# Altium schematic sheet MCU.SchDoc
size A
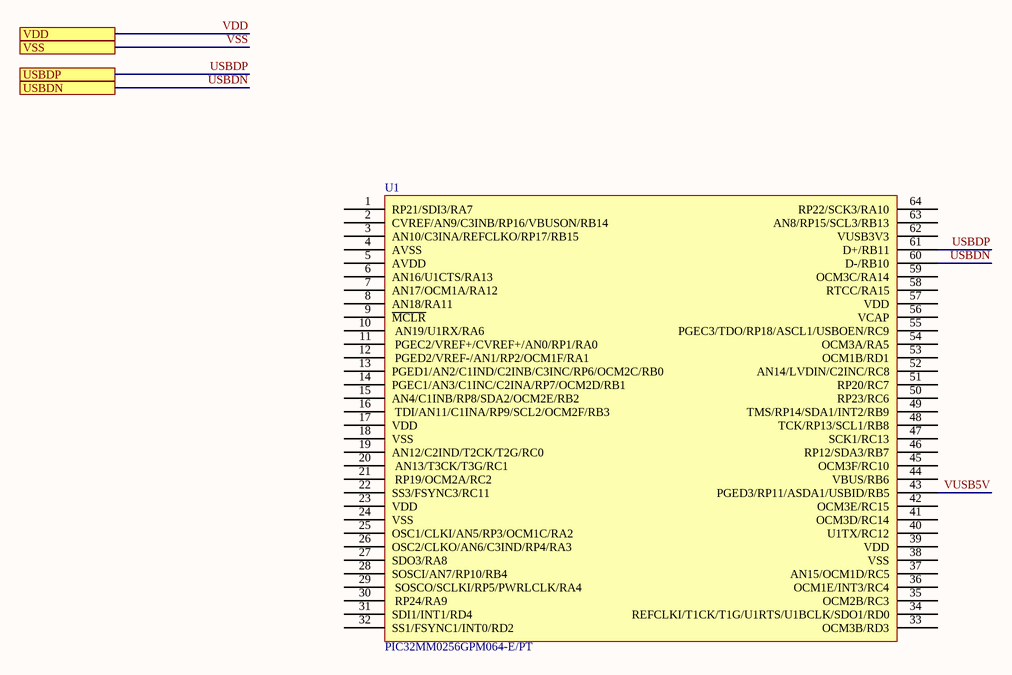
[diagram p0: MCU.SchDoc]

## Parts
U1  PIC32MM0256GPM064-E/PT  [TQFP-64]

## Ports
USBDN, USBDP, VDD, VSS

## Nets
USBDN: U1.60(D-/RB10) ; port USBDN
USBDP: U1.61(D+/RB11) ; port USBDP
VDD: port VDD
VSS: port VSS
VUSB5V: U1.43(PGED3/RP11/ASDA1/USBID/RB5)

Not connected (* = marked no-connect by the designer): U1 1(RP21/SDI3/RA7) 2(CVREF/AN9/C3INB/RP16/VBUSON/RB14) 3(AN10/C3INA/REFCLKO/RP17/RB15) 4(AVSS) 5(AVDD) 6(AN16/U1CTS/RA13) 7(AN17/OCM1A/RA12) 8(AN18/RA11) 9(~{MCLR}) 10(_AN19/U1RX/RA6) 11(_PGEC2/VREF+/CVREF+/AN0/RP1/RA0) 12(_PGED2/VREF-/AN1/RP2/OCM1F/RA1) 13(PGED1/AN2/C1IND/C2INB/C3INC/RP6/OCM2C/RB0) 14(PGEC1/AN3/C1INC/C2INA/RP7/OCM2D/RB1) 15(AN4/C1INB/RP8/SDA2/OCM2E/RB2) 16(_TDI/AN11/C1INA/RP9/SCL2/OCM2F/RB3) 17(VDD) 18(VSS) 19(AN12/C2IND/T2CK/T2G/RC0) 20(_AN13/T3CK/T3G/RC1) 21(_RP19/OCM2A/RC2) 22(SS3/FSYNC3/RC11) 23(VDD) 24(VSS) 25(OSC1/CLKI/AN5/RP3/OCM1C/RA2_) 26(OSC2/CLKO/AN6/C3IND/RP4/RA3) 27(SDO3/RA8) 28(SOSCI/AN7/RP10/RB4) 29(_SOSCO/SCLKI/RP5/PWRLCLK/RA4) 30(_RP24/RA9) 31(SDI1/INT1/RD4) 32(SS1/FSYNC1/INT0/RD2) 33(OCM3B/RD3) 34(REFCLKI/T1CK/T1G/U1RTS/U1BCLK/SDO1/RD0) 35(OCM2B/RC3) 36(_OCM1E/INT3/RC4) 37(_AN15/OCM1D/RC5) 38(VSS) 39(VDD) 40(U1TX/RC12) 41(OCM3D/RC14) 42(OCM3E/RC15) 44(VBUS/RB6) 45(OCM3F/RC10) 46(RP12/SDA3/RB7) 47(SCK1/RC13) 48(TCK/RP13/SCL1/RB8) 49(_TMS/RP14/SDA1/INT2/RB9) 50(RP23/RC6) 51(RP20/RC7) 52(AN14/LVDIN/C2INC/RC8) 53(OCM1B/RD1) 54(OCM3A/RA5) 55(_PGEC3/TDO/RP18/ASCL1/USBOEN/RC9) 56(VCAP) 57(VDD) 58(RTCC/RA15) 59(OCM3C/RA14) 62(VUSB3V3) 63(AN8/RP15/SCL3/RB13) 64(RP22/SCK3/RA10)

## Library data of the parts
U1 = PIC32MM0256GPM064-E/PT: 32-bit Microcontrollers - MCU 256KB Flash, 32KB RAM, 79 CoreMark at 25MHz, Low Power microMIPS; Populate: P; Value: PIC32MM0256GPM064-E/PT; ComponentLink1Description: ProductPage; ComponentLink1URL: https://www.mouser.com/ProductDetail/Microchip-Technology/PIC32MM0256GPM064-E-PT?qs=vLWxofP3U2zwedJscrafvw%3D%3D